# Altium schematic sheet main.SchDoc
size A4; SheetNumber: 1; SheetTotal: 1
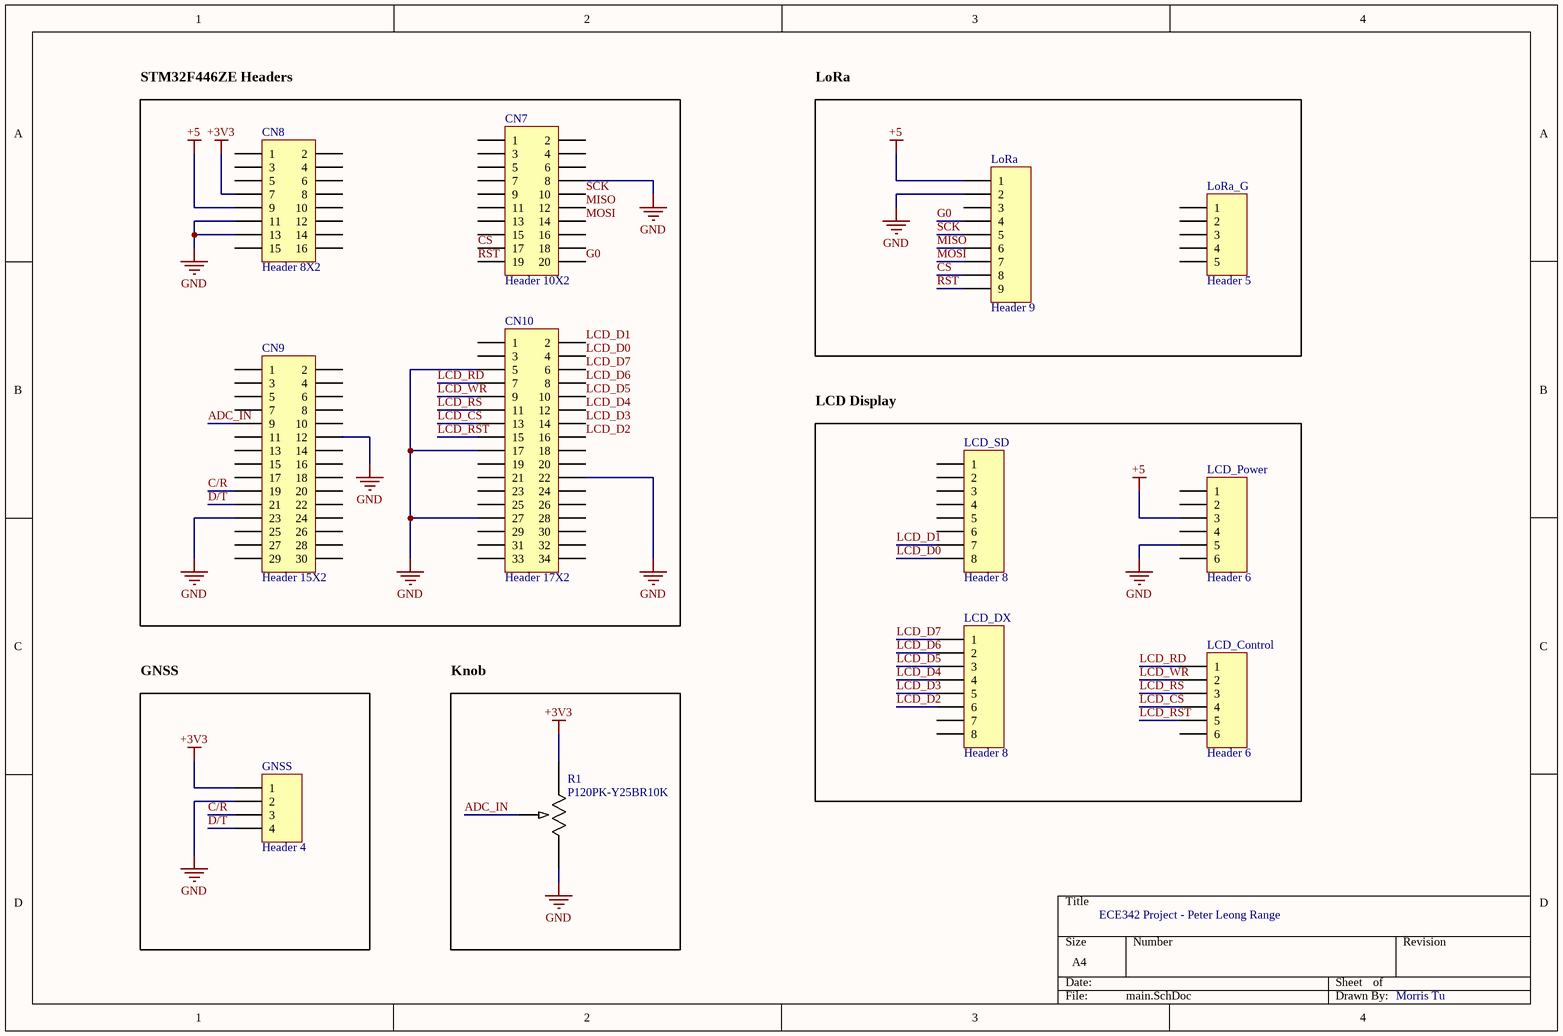
[diagram p0: main.SchDoc]

## Parts
CN7  Header 10X2  [HDR2X10]
CN8  Header 8X2  [HDR2X8]
CN9  Header 15X2  [HDR2X15]
CN10  Header 17X2  [HDR2X17]
GNSS  Header 4  [HDR1X4]
LCD_Control  Header 6  [HDR1X6]
LCD_DX  Header 8  [HDR1X8]
LCD_Power  Header 6  [HDR1X6]
LCD_SD  Header 8  [HDR1X8]
LoRa  Header 9  [HDR1X9]
LoRa_G  Header 5  [HDR1X5]
R1  P120PK-Y25BR10K  [POT_P120PK-x25_TTE]

## Blocks framed on the sheet
STM32F446ZE Headers: CN7-CN10
LoRa: LoRa LoRa_G
LCD Display: LCD_Control LCD_DX LCD_Power LCD_SD
GNSS: GNSS
Knob: R1

## Nets
+3V3: CN8.7 GNSS.1 R1.3
+5: CN8.9 LCD_Power.3 LoRa.1
GND: CN7.8 CN8.11 CN8.13 CN9.12 CN9.23 CN10.5 CN10.17 CN10.22 CN10.27 GNSS.2 LCD_Power.5 LoRa.2 R1.1
ADC_IN: CN9.9 R1.2
C/R: CN9.19 GNSS.3
CS: CN7.17 LoRa.8
D/T: CN9.21 GNSS.4
G0: CN7.20 LoRa.4
LCD_CS: CN10.13 LCD_Control.4
LCD_D0: CN10.4 LCD_SD.8
LCD_D1: CN10.2 LCD_SD.7
LCD_D2: CN10.16 LCD_DX.6
LCD_D3: CN10.14 LCD_DX.5
LCD_D4: CN10.12 LCD_DX.4
LCD_D5: CN10.10 LCD_DX.3
LCD_D6: CN10.8 LCD_DX.2
LCD_D7: CN10.6 LCD_DX.1
LCD_RD: CN10.7 LCD_Control.1
LCD_RS: CN10.11 LCD_Control.3
LCD_RST: CN10.15 LCD_Control.5
LCD_WR: CN10.9 LCD_Control.2
MISO: CN7.12 LoRa.6
MOSI: CN7.14 LoRa.7
RST: CN7.19 LoRa.9
SCK: CN7.10 LoRa.5

Not connected (* = marked no-connect by the designer): CN7 1 2 3 4 5 6 7 9 11 13 15 16 18; CN8 1 2 3 4 5 6 8 10 12 14 15 16; CN9 1 2 3 4 5 6 7 8 10 11 13 14 15 16 17 18 20 22 24 25 26 27 28 29 30; CN10 1 3 18 19 20 21 23 24 25 26 28 29 30 31 32 33 34; LCD_Control 6; LCD_DX 7 8; LCD_Power 1 2 4 6; LCD_SD 1 2 3 4 5 6; LoRa 3; LoRa_G 1 2 3 4 5

## Notes on the sheet
- ECE342 Project - Peter Leong Range
- Morris Tu

## Library data of the parts
CN7 = Header 10X2: Header, 10-Pin, Dual row; LatestRevisionDate: 17-Jul-2002; LatestRevisionNote: Re-released for DXP Platform.; Publisher: Altium Limited
CN8 = Header 8X2: Header, 8-Pin, Dual row; LatestRevisionDate: 17-Jul-2002; LatestRevisionNote: Re-released for DXP Platform.; Publisher: Altium Limited
CN9 = Header 15X2: Header, 15-Pin, Dual row; LatestRevisionDate: 17-Jul-2002; LatestRevisionNote: Re-released for DXP Platform.; Publisher: Altium Limited
CN10 = Header 17X2: Header, 17-Pin, Dual row; LatestRevisionDate: 17-Jul-2002; LatestRevisionNote: Re-released for DXP Platform.; Publisher: Altium Limited
GNSS = Header 4: Header, 4-Pin; LatestRevisionDate: 17-Jul-2002; LatestRevisionNote: Re-released for DXP Platform.; Publisher: Altium Limited
LCD_Control LCD_Power = Header 6: Header, 6-Pin; LatestRevisionDate: 17-Jul-2002; LatestRevisionNote: Re-released for DXP Platform.; Publisher: Altium Limited
LCD_DX LCD_SD = Header 8: Header, 8-Pin; LatestRevisionDate: 17-Jul-2002; LatestRevisionNote: Re-released for DXP Platform.; Publisher: Altium Limited
LoRa = Header 9: Header, 9-Pin; LatestRevisionDate: 17-Jul-2002; LatestRevisionNote: Re-released for DXP Platform.; Publisher: Altium Limited
LoRa_G = Header 5: Header, 5-Pin; LatestRevisionDate: 17-Jul-2002; LatestRevisionNote: Re-released for DXP Platform.; Publisher: Altium Limited
R1 = P120PK-Y25BR10K: Description; Manufacturer_Name: TT Electronics; Copyright: Copyright (C) 2025 Ultra Librarian. All rights reserved.; Manufacturer_Part_Number: P120PK-Y25BR10K